# Altium project TG21_mach_nut_nhan _V1_ReV.PrjPcb (part 3 of 3)

## Sheet CONNECTOR.SchDoc
size A4; SheetNumber: 6; SheetTotal: 6
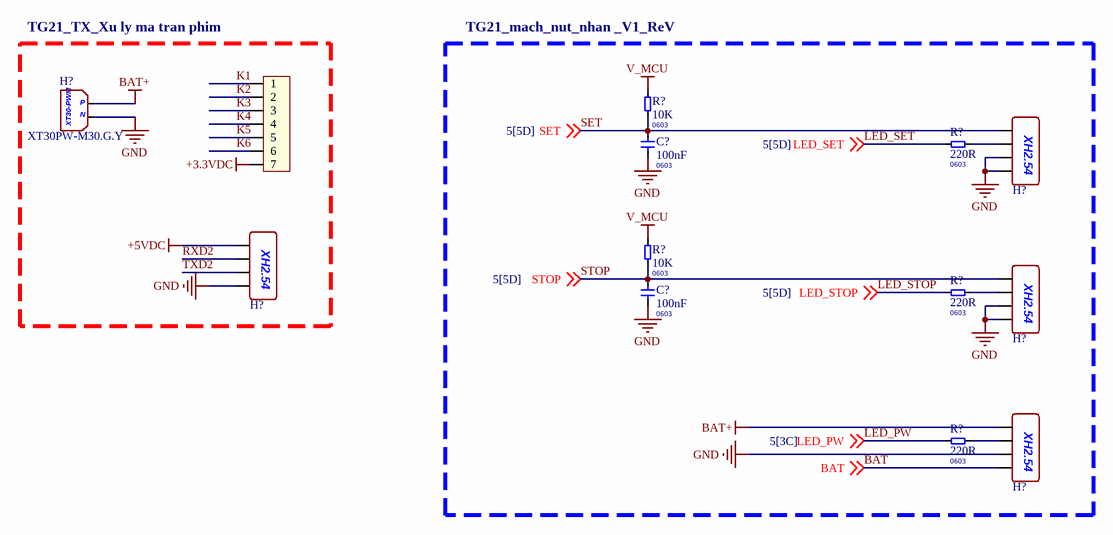
[diagram p7: CONNECTOR.SchDoc]

### Parts
(Parts that share a designator on the sheet are numbered #1, #2 ... from top to bottom, then left to right.)
C?#30  100nF  Package: 0603  [0603 MLCC]
C?#31  100nF  Package: 0603  [0603 MLCC]
H?#1  Header 7P 2.54 Duc Thang  [XH2.54M-7]  (value not drawn)
H?#2  XT30PW-M30.G.Y  [XT30]
H?#3  XY-XH2.54-4PZZ  [XH2.54 - 4PZZ]  (value not drawn)
H?#4  XY-XH2.54-4PZZ  [XH2.54 - 4PZZ]  (value not drawn)
H?#5  XY-XH2.54-4PZZ  [XH2.54 - 4PZZ]  (value not drawn)
H?#6  XY-XH2.54-4PZZ  [XH2.54 - 4PZZ]  (value not drawn)
R?#23  10K  Package: 0603  [0603 Resistors]
R?#24  220R  Package: 0603  [0603 Resistors]
R?#25  10K  Package: 0603  [0603 Resistors]
R?#26  220R  Package: 0603  [0603 Resistors]
R?#27  220R  Package: 0603  [0603 Resistors]

### Blocks framed on the sheet
TG21_TX_Xu ly ma tran phim: H?#1 H?#2 H?#4
TG21_mach_nut_nhan _V1_ReV: C?#30 C?#31 H?#3 H?#5 H?#6 R?#23-R?#27

### Nets
+3.3VDC: H?#1.7  [project net VDDA]
+5VDC: H?#4.4  [project net VOUT]
BAT+: H?#2.1 H?#6.4
GND: C?#30.2 C?#31.2 H?#2.2 H?#3.1 H?#3.2 H?#4.1 H?#5.1 H?#5.2 H?#6.2
V_MCU: R?#23.2 R?#25.2
BAT: H?#6.1 ; off-sheet BAT
K1: H?#1.1
K2: H?#1.2
K3: H?#1.3
K4: H?#1.4
K5: H?#1.5
K6: H?#1.6
LED_PW: R?#27.1 ; off-sheet LED_PW
LED_SET: R?#24.1 ; off-sheet LED_SET
LED_STOP: R?#26.1 ; off-sheet LED_STOP
RXD2: H?#4.3  [project net PA2]
SET: C?#30.1 H?#3.4 R?#23.1 ; off-sheet SET  [project net PB2]
STOP: C?#31.1 H?#5.4 R?#25.1 ; off-sheet STOP  [project net PE8]
TXD2: H?#4.2  [project net PA3]
NetH?#3_3: H?#3.3 R?#24.2
NetH?#5_3: H?#5.3 R?#26.2
NetH?#6_3: H?#6.3 R?#27.2

### Notes on the sheet
- Author:
- Title:
- Size:
- A4
- Project:
- Approved:
- Revision:
- Modified Date:
- CONFIDENTIAL
- Date:
- SW Version:
- (in symbol XH2.54 4PZZ) XH2.54
- (in symbol XT30PW-M30.G.Y) P; N; XT30-PWM

### Library data of the parts
C?#30 C?#31 = 0603 100nF: 100nF ±10% 50V Ceramic Capacitor X7R 0603; Manufacturer: YAGEO; Mfr. Part #: CC0603KRX7R9BB104; LCSC Part #: C14663; ComponentLink1Description: LCSC Link; ComponentLink1URL: https://www.lcsc.com/product-detail/C14663.html?s_z=n_0603%2520100nF
H?#1 = Header 7P 2.54 Duc Thang: Cắm; Ten_Linh_Kien: Header 7P XH2.54-7P Đực Thẳng; Don_Vi: Con; Ma_Hang: MH003369; Chung_Loai: Cắm
H?#2 = XT30PW-M30.G.Y: AMASS XT30PW-M30.G.Y; Manufacturer: Changzhou Amass Elec; Mfr. Part #: XT30PW-M30.G.Y; LCSC Part #: C431092; ComponentLink1Description: LCSC Link; ComponentLink1URL: https://www.lcsc.com/product-detail/C431092.html?s_z=n_q_xt30pw&spm=wm.fly.bg.0.xh&lcsc_vid=QQBdBlYAQFFWUgBXTlUPAgFQQQIIBQIHEQIPAgJRQFAxVlNRT1ddX1xWQlNaUzsOAxUeFF5JWBYZEEoKFBINSQcJGk4eFQsCAgIaSgADAwAHC0slQllfX11TQk8GEwkK; ComponentLink2Description: Datasheet; ComponentLink2URL: https://www.lcsc.com/datasheet/C431092.pdf?spm=wm.sxq.inf.ggs___wm.fly.bg.0.xh&lcsc_vid=QQBdBlYAQFFWUgBXTlUPAgFQQQIIBQIHEQIPAgJRQFAxVlNRT1ddX1xWQlNaUzsOAxUeFF5JWBYZEEoKFBINSQcJGk4eFQsCAgIaSgADAwAHC0slQllfX11TQk8GEwkK; Type: Connector/Header; Assembly Type: DIP Assembly; Value: XT30PW-M30.G.Y
H?#3-H?#6 = XH2.54 4PZZ: XH 1 4P -25℃~+85℃ 2.54mm 4 2A 250V 1x4P Through Hole,P=2.54mm Headers, Male Pins RoHS; Manufacturer: XYECONN; Mfr. Part #: XY-XH2.54-4PZZ; LCSC Part #: C53201003; ComponentLink1Description: LCSC Link; ComponentLink1URL: https://www.lcsc.com/product-detail/C53201003.html?s_z=n_XH2.54%25204P; Package: Through Hole,P=2.54mm; Type: Header; Assembly Type: DIP Assembly; ComponentLink2Description: Datasheet; ComponentLink2URL: https://www.lcsc.com/datasheet/C53201003.pdf
R?#23 R?#25 = 0603 10K: 100mW 10kΩ 75V Thick Film Resistor ±1% ±100ppm/℃ 0603 Chip Resistor - Surface Mount RoHS; Manufacturer: VISHAY; Mfr. Part #: CRCW060310K0FKEA; LCSC Part #: C844918; ComponentLink1Description: LCSC Link; ComponentLink1URL: https://www.lcsc.com/product-detail/C844918.html?s_z=n_10K
R?#24 R?#26 R?#27 = 0603 220R: 100mW 220Ω 75V Thick Film Resistor ±1% ±100ppm/℃ 0603 Chip Resistor - Surface Mount RoHS; Mfr. Part #: CRCW0603220RFKEAHP; Manufacturer: VISHAY; LCSC Part #: C313707; ComponentLink1Description: LCSC Link; ComponentLink1URL: https://www.lcsc.com/product-detail/C313707.html?s_z=n_0603%2520220R; Value: 220R

## Nets that join several sheets
+24VDC: Voltage Source (C?#2.2 C?#3.2 D?#1.2 R?#6.2), TG21_mach_nut_nhan _V1_ReV (105 pins)
BAT+: Voltage Source (C?#29.2 Q?#3.3 R?#19.2), CONNECTOR (H?#2.1 H?#6.4)
GND: Voltage Source (39 pins), TG21_mach_nut_nhan _V1_ReV (235 pins), TG21_TX_Xu ly ma tran phim (11 pins), CONNECTOR (9 pins)
V_MCU: TG21_mach_nut_nhan _V1_ReV (39 pins), CONNECTOR (R?#23.2 R?#25.2)
VDDA: TG21_mach_nut_nhan _V1_ReV (26 pins), TG21_TX_Xu ly ma tran phim (17 pins), CONNECTOR (H?#1.7)
VOUT: Voltage Source (7 pins), TG21_TX_Xu ly ma tran phim (7 pins), CONNECTOR (H?#4.4)
ADC_BAT: Voltage Source (C?#28.1 R?#13.1 R?#14.1), TG21_TX_Xu ly ma tran phim (U4#2.18)
BAT: Voltage Source (R?#15.1), CONNECTOR (H?#6.1)
C1: TG21_mach_nut_nhan _V1_ReV (9 pins), TG21_TX_Xu ly ma tran phim (U4#2.81)
C2: TG21_mach_nut_nhan _V1_ReV (9 pins), TG21_TX_Xu ly ma tran phim (U4#2.82)
C3: TG21_mach_nut_nhan _V1_ReV (9 pins), TG21_TX_Xu ly ma tran phim (U4#2.83)
C4: TG21_mach_nut_nhan _V1_ReV (9 pins), TG21_TX_Xu ly ma tran phim (U4#2.84)
C5: TG21_mach_nut_nhan _V1_ReV (9 pins), TG21_TX_Xu ly ma tran phim (U4#2.85)
C6: TG21_mach_nut_nhan _V1_ReV (9 pins), TG21_TX_Xu ly ma tran phim (U4#2.86)
C7: TG21_mach_nut_nhan _V1_ReV (9 pins), TG21_TX_Xu ly ma tran phim (U4#2.87)
C8: TG21_mach_nut_nhan _V1_ReV (9 pins), TG21_TX_Xu ly ma tran phim (U4#2.88)
C9: TG21_mach_nut_nhan _V1_ReV (9 pins), TG21_TX_Xu ly ma tran phim (U4#2.55)
C10: TG21_mach_nut_nhan _V1_ReV (9 pins), TG21_TX_Xu ly ma tran phim (U4#2.56)
C11: TG21_mach_nut_nhan _V1_ReV (9 pins), TG21_TX_Xu ly ma tran phim (U4#2.57)
C12: TG21_mach_nut_nhan _V1_ReV (9 pins), TG21_TX_Xu ly ma tran phim (U4#2.58)
C13: TG21_mach_nut_nhan _V1_ReV (9 pins), TG21_TX_Xu ly ma tran phim (U4#2.59)
H1: TG21_mach_nut_nhan _V1_ReV (13 pins), TG21_TX_Xu ly ma tran phim (U4#2.97)
H2: TG21_mach_nut_nhan _V1_ReV (13 pins), TG21_TX_Xu ly ma tran phim (U4#2.98)
H3: TG21_mach_nut_nhan _V1_ReV (13 pins), TG21_TX_Xu ly ma tran phim (U4#2.1)
H4: TG21_mach_nut_nhan _V1_ReV (13 pins), TG21_TX_Xu ly ma tran phim (U4#2.2)
H5: TG21_mach_nut_nhan _V1_ReV (13 pins), TG21_TX_Xu ly ma tran phim (U4#2.3)
H6: TG21_mach_nut_nhan _V1_ReV (13 pins), TG21_TX_Xu ly ma tran phim (U4#2.4)
H7: TG21_mach_nut_nhan _V1_ReV (13 pins), TG21_TX_Xu ly ma tran phim (U4#2.5)
K1: TG21_TX_Xu ly ma tran phim (U4#2.41), CONNECTOR (H?#1.1)
K2: TG21_TX_Xu ly ma tran phim (U4#2.42), CONNECTOR (H?#1.2)
K3: TG21_TX_Xu ly ma tran phim (U4#2.43), CONNECTOR (H?#1.3)
K4: TG21_TX_Xu ly ma tran phim (U4#2.44), CONNECTOR (H?#1.4)
K5: TG21_TX_Xu ly ma tran phim (U4#2.45), CONNECTOR (H?#1.5)
K6: TG21_TX_Xu ly ma tran phim (U4#2.46), CONNECTOR (H?#1.6)
LED_PW: TG21_TX_Xu ly ma tran phim (U4#2.17), CONNECTOR (R?#27.1)
LED_SET: TG21_TX_Xu ly ma tran phim (U4#2.38), CONNECTOR (R?#24.1)
LED_STOP: TG21_TX_Xu ly ma tran phim (U4#2.40), CONNECTOR (R?#26.1)
MCU_BT: Voltage Source (R?#15.2 R?#16.2 R?#17.2), TG21_TX_Xu ly ma tran phim (U4#2.15)
MCU_EN: Voltage Source (R?#21.2), TG21_TX_Xu ly ma tran phim (U4#2.16)
PA2: TG21_TX_Xu ly ma tran phim (U4#2.25), CONNECTOR (H?#4.3)
PA3: TG21_TX_Xu ly ma tran phim (U4#2.26), CONNECTOR (H?#4.2)
PB2: TG21_TX_Xu ly ma tran phim (U4#2.37), CONNECTOR (C?#30.1 H?#3.4 R?#23.1)
PC10: TG21_mach_nut_nhan _V1_ReV (13 pins), TG21_TX_Xu ly ma tran phim (U4#2.78)
PC11: TG21_mach_nut_nhan _V1_ReV (13 pins), TG21_TX_Xu ly ma tran phim (U4#2.79)
PC12: TG21_mach_nut_nhan _V1_ReV (U1.14), TG21_TX_Xu ly ma tran phim (U4#2.80)
PE8: TG21_TX_Xu ly ma tran phim (U4#2.39), CONNECTOR (C?#31.1 H?#5.4 R?#25.1)